# Altium schematic sheet Non Relay Fuses with blwn fuse indicator.SchDoc
size A
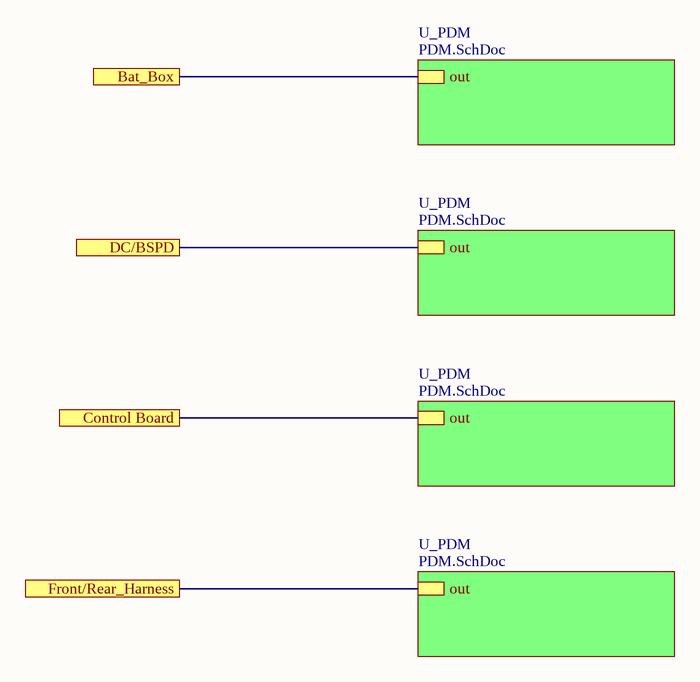
[diagram p0: Non Relay Fuses with blwn fuse indicator.SchDoc]

## Sub-sheets
U_PDM = PDM.SchDoc: out
U_PDM = PDM.SchDoc: out
U_PDM = PDM.SchDoc: out
U_PDM = PDM.SchDoc: out

## Ports
Bat_Box, Control Board, DC/BSPD, Front/Rear_Harness

## Nets
Bat_Box: port Bat_Box, sheet U_PDM/out
Control Board: port Control Board, sheet U_PDM/out
DC/BSPD: port DC/BSPD, sheet U_PDM/out
Front/Rear_Harness: port Front/Rear_Harness, sheet U_PDM/out